# Altium schematic sheet Top.SchDoc
size A; SheetNumber: 1; SheetTotal: 8
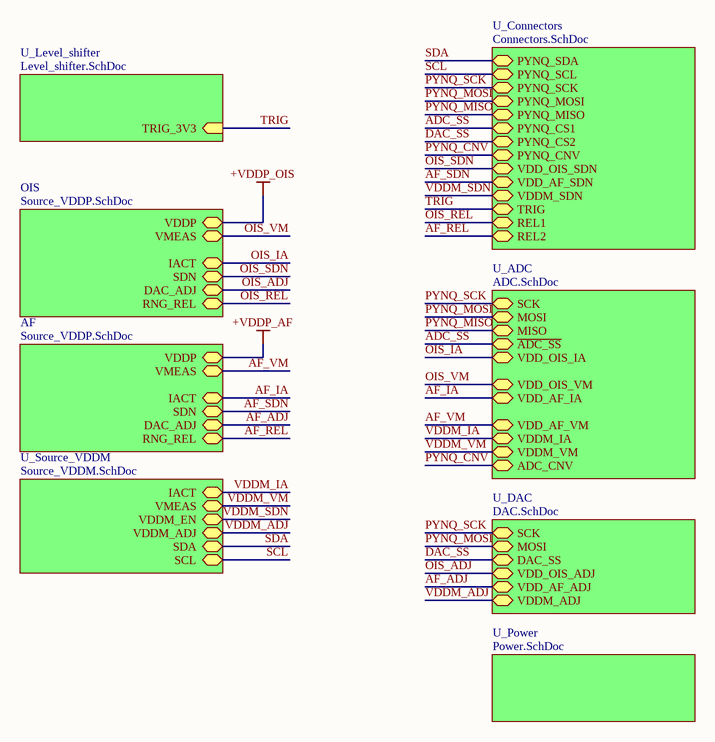
[diagram p0: Top.SchDoc]

## Sub-sheets
AF = Source_VDDP.SchDoc: DAC_ADJ (bidir), SDN (bidir), IACT (bidir), VMEAS (bidir), VDDP (bidir), RNG_REL (bidir)
OIS = Source_VDDP.SchDoc: DAC_ADJ (bidir), SDN (bidir), IACT (bidir), VMEAS (bidir), VDDP (bidir), RNG_REL (bidir)
U_ADC = ADC.SchDoc: VDD_OIS_IA (bidir), SCK (bidir), MOSI (bidir), MISO (bidir), ~{ADC_SS} (bidir), VDD_OIS_VM (bidir), VDD_AF_IA (bidir), VDD_AF_VM (bidir), VDDM_IA (bidir), VDDM_VM (bidir), ADC_CNV (bidir)
U_Connectors = Connectors.SchDoc: PYNQ_SDA (bidir), PYNQ_SCL (bidir), PYNQ_SCK (bidir), PYNQ_MOSI (bidir), PYNQ_MISO (bidir), PYNQ_CS1 (bidir), PYNQ_CS2 (bidir), PYNQ_CNV (bidir), VDD_OIS_SDN (bidir), VDD_AF_SDN (bidir), VDDM_SDN (bidir), TRIG (bidir), REL2 (bidir), REL1 (bidir)
U_DAC = DAC.SchDoc: SCK (bidir), MOSI (bidir), DAC_SS (bidir), VDD_AF_ADJ (bidir), VDDM_ADJ (bidir), VDD_OIS_ADJ (bidir)
U_Level_shifter = Level_shifter.SchDoc: TRIG_3V3 (in)
U_Power = Power.SchDoc: no entries
U_Source_VDDM = Source_VDDM.SchDoc: SCL (bidir), SDA (bidir), VDDM_ADJ (bidir), VDDM_EN (bidir), VMEAS (bidir), IACT (bidir)

## Nets
+VDDP_AF: sheet AF/VDDP
+VDDP_OIS: sheet OIS/VDDP
ADC_SS: sheet U_ADC/~{ADC_SS}, sheet U_Connectors/PYNQ_CS1
AF_ADJ: sheet AF/DAC_ADJ, sheet U_DAC/VDD_AF_ADJ
AF_IA: sheet U_ADC/VDD_AF_IA, sheet AF/IACT
AF_REL: sheet AF/RNG_REL, sheet U_Connectors/REL2
AF_SDN: sheet AF/SDN, sheet U_Connectors/VDD_AF_SDN
AF_VM: sheet U_ADC/VDD_AF_VM, sheet AF/VMEAS
DAC_SS: sheet U_DAC/DAC_SS, sheet U_Connectors/PYNQ_CS2
OIS_ADJ: sheet OIS/DAC_ADJ, sheet U_DAC/VDD_OIS_ADJ
OIS_IA: sheet U_ADC/VDD_OIS_IA, sheet OIS/IACT
OIS_REL: sheet OIS/RNG_REL, sheet U_Connectors/REL1
OIS_SDN: sheet OIS/SDN, sheet U_Connectors/VDD_OIS_SDN
OIS_VM: sheet U_ADC/VDD_OIS_VM, sheet OIS/VMEAS
PYNQ_CNV: sheet U_ADC/ADC_CNV, sheet U_Connectors/PYNQ_CNV
PYNQ_MISO: sheet U_ADC/MISO, sheet U_Connectors/PYNQ_MISO
PYNQ_MOSI: sheet U_ADC/MOSI, sheet U_DAC/MOSI, sheet U_Connectors/PYNQ_MOSI
PYNQ_SCK: sheet U_ADC/SCK, sheet U_DAC/SCK, sheet U_Connectors/PYNQ_SCK
SCL: sheet U_Source_VDDM/SCL, sheet U_Connectors/PYNQ_SCL
SDA: sheet U_Source_VDDM/SDA, sheet U_Connectors/PYNQ_SDA
TRIG: sheet U_Connectors/TRIG, sheet U_Level_shifter/TRIG_3V3
VDDM_ADJ: sheet U_DAC/VDDM_ADJ, sheet U_Source_VDDM/VDDM_ADJ
VDDM_IA: sheet U_ADC/VDDM_IA, sheet U_Source_VDDM/IACT
VDDM_SDN: sheet U_Source_VDDM/VDDM_EN, sheet U_Connectors/VDDM_SDN
VDDM_VM: sheet U_ADC/VDDM_VM, sheet U_Source_VDDM/VMEAS